# EasyEDA schematic Covox backplate.json
TITLE: Sheet_1; REV: 1.0; Date: 2020-06-03; Sheet: 1/1; Company: Your Company
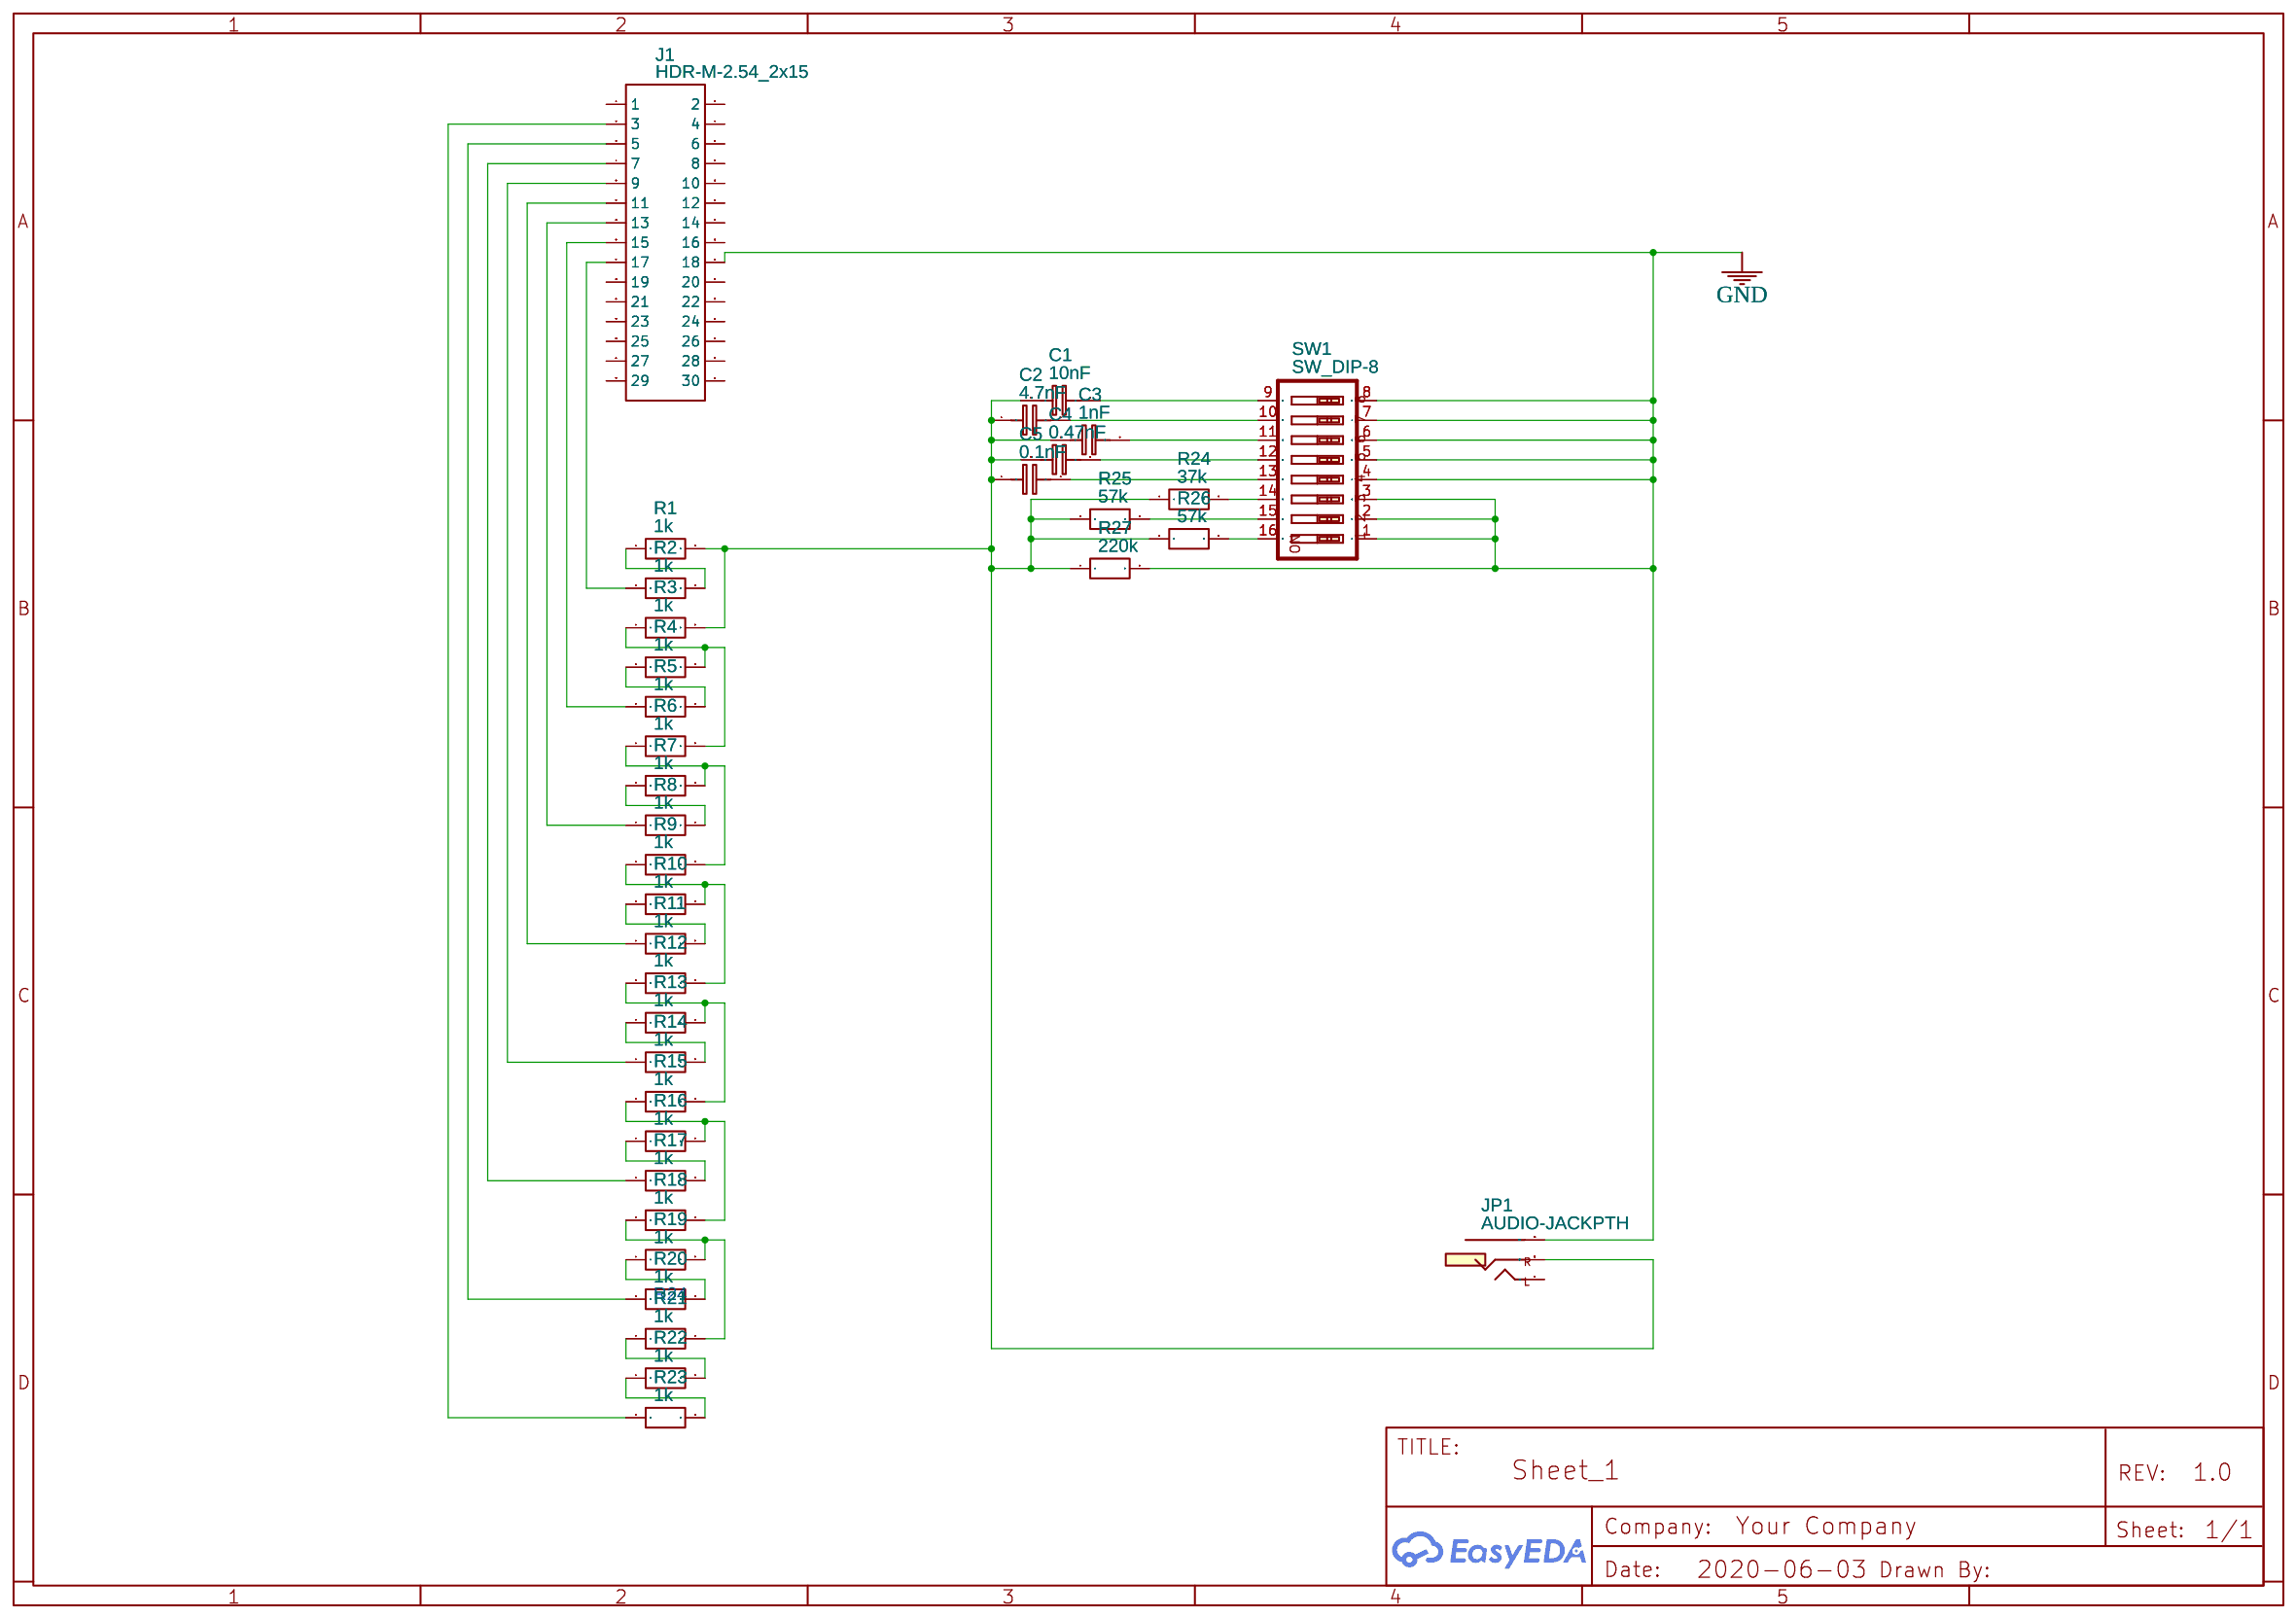
[diagram p0: schematic sheet]

## Parts
C1  10nF  [470PF]
C2  4.7nF  [470PF]
C3  1nF  [470PF]
C4  0.47nF  [470PF]
C5  0.1nF  [470PF]
J1  HDR-M-2.54_2x15  [HDR-M-2.54_2X15]
JP1  AUDIO-JACKPTH  [AUDIO-JACK]
R1  1k  [R_AXIAL-0.3]
R2  1k  [R_AXIAL-0.3]
R3  1k  [R_AXIAL-0.3]
R4  1k  [R_AXIAL-0.3]
R5  1k  [R_AXIAL-0.3]
R6  1k  [R_AXIAL-0.3]
R7  1k  [R_AXIAL-0.3]
R8  1k  [R_AXIAL-0.3]
R9  1k  [R_AXIAL-0.3]
R10  1k  [R_AXIAL-0.3]
R11  1k  [R_AXIAL-0.3]
R12  1k  [R_AXIAL-0.3]
R13  1k  [R_AXIAL-0.3]
R14  1k  [R_AXIAL-0.3]
R15  1k  [R_AXIAL-0.3]
R16  1k  [R_AXIAL-0.3]
R17  1k  [R_AXIAL-0.3]
R18  1k  [R_AXIAL-0.3]
R19  1k  [R_AXIAL-0.3]
R20  1k  [R_AXIAL-0.3]
R21  1k  [R_AXIAL-0.3]
R22  1k  [R_AXIAL-0.3]
R23  1k  [R_AXIAL-0.3]
R24  37k  [R_AXIAL-0.4]
R25  57k  [R_AXIAL-0.4]
R26  57k  [R_AXIAL-0.4]
R27  220k  [R_AXIAL-0.4]
SW1  SW_DIP-8  [DIPSWITCH-08]

## Library data of the parts
C1-C5 = C_0201_EU: Contributor: LCEDA_Lib
J1 = HDR-M-2.54_2x15: Supplier Part: C56496; Supplier: LCSC; Contributor: LCEDA_Lib
JP1 = AUDIO-JACKPTH: 3.5mm Audio Jack; Contributor: SparkFun
R1-R27 = R_0201_EU: Contributor: LCEDA_Lib
SW1 = SW_DIP-8: DIP Switch 8 Position; Contributor: SparkFun

## Nets
GND: J1.18 JP1.SLEEVE R27.2 SW1.1 SW1.2 SW1.3 SW1.4 SW1.5 SW1.6 SW1.7 SW1.8
Net-(C1-1): C1.1 C2.1 C3.1 C4.1 C5.1 JP1.RING(RIGHT) R1.2 R3.2 R24.1 R25.1 R26.1 R27.1
Net-(C1-2): C1.2 SW1.9
Net-(C2-2): C2.2 SW1.10
Net-(C3-2): C3.2 SW1.11
Net-(C4-2): C4.2 SW1.12
Net-(C5-2): C5.2 SW1.13
Net-(J1-3): J1.3 R23.1
Net-(J1-5): J1.5 R20.1
Net-(J1-7): J1.7 R17.1
Net-(J1-9): J1.9 R14.1
Net-(J1-11): J1.11 R11.1
Net-(J1-13): J1.13 R8.1
Net-(J1-15): J1.15 R5.1
Net-(J1-17): J1.17 R2.1
Net-(R1-1): R1.1 R2.2
Net-(R3-1): R3.1 R4.2 R6.2
Net-(R4-1): R4.1 R5.2
Net-(R6-1): R6.1 R7.2 R9.2
Net-(R7-1): R7.1 R8.2
Net-(R9-1): R9.1 R10.2 R12.2
Net-(R10-1): R10.1 R11.2
Net-(R12-1): R12.1 R13.2 R15.2
Net-(R13-1): R13.1 R14.2
Net-(R15-1): R15.1 R16.2 R18.2
Net-(R16-1): R16.1 R17.2
Net-(R18-1): R18.1 R19.2 R21.2
Net-(R19-1): R19.1 R20.2
Net-(R21-1): R21.1 R22.2
Net-(R22-1): R22.1 R23.2
Net-(R24-2): R24.2 SW1.14
Net-(R25-2): R25.2 SW1.15
Net-(R26-2): R26.2 SW1.16

Not connected (* = marked no-connect by the designer): J1 1 2 4 6 8 10 12 14 16 19 20 21 22 23 24 25 26 27 28 29 30; JP1 TIP(LEFT)

## Notes on the sheet
- R24
